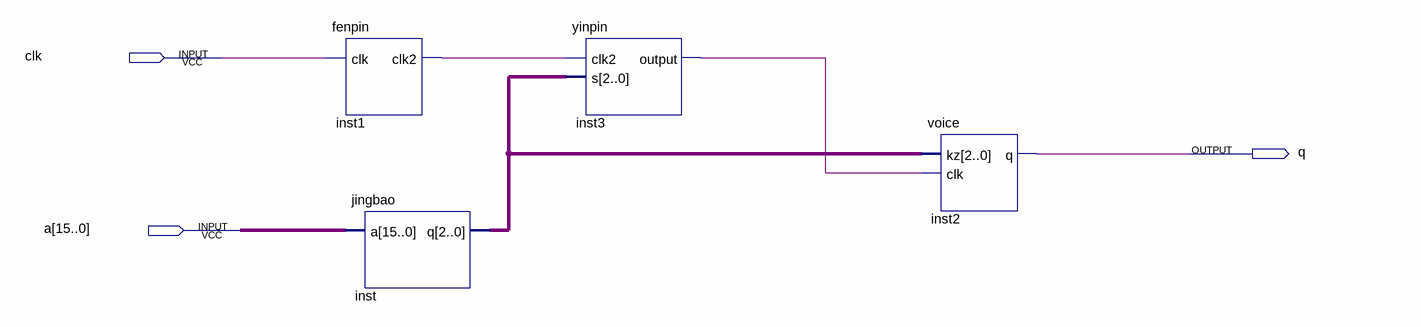
[diagram p0: schematic sheet]
// Quartus schematic fasheng.bdf as structural Verilog: 4 symbols, 3 pins
module fasheng (
  input  clk,
  input  [15:0] a,
  output q
);

  wire inst1_clk2, inst3_output;
  wire [2:0] inst_q;

  fenpin inst1 (.clk(clk), .clk2(inst1_clk2));
  jingbao inst (.a(a), .q(inst_q));
  yinpin inst3 (.clk2(inst1_clk2), .s(inst_q), .\output (inst3_output));
  voice inst2 (.kz(inst_q), .clk(inst3_output), .q(q));
endmodule
